# Altium schematic sheet mitosis.SchDoc
size A4
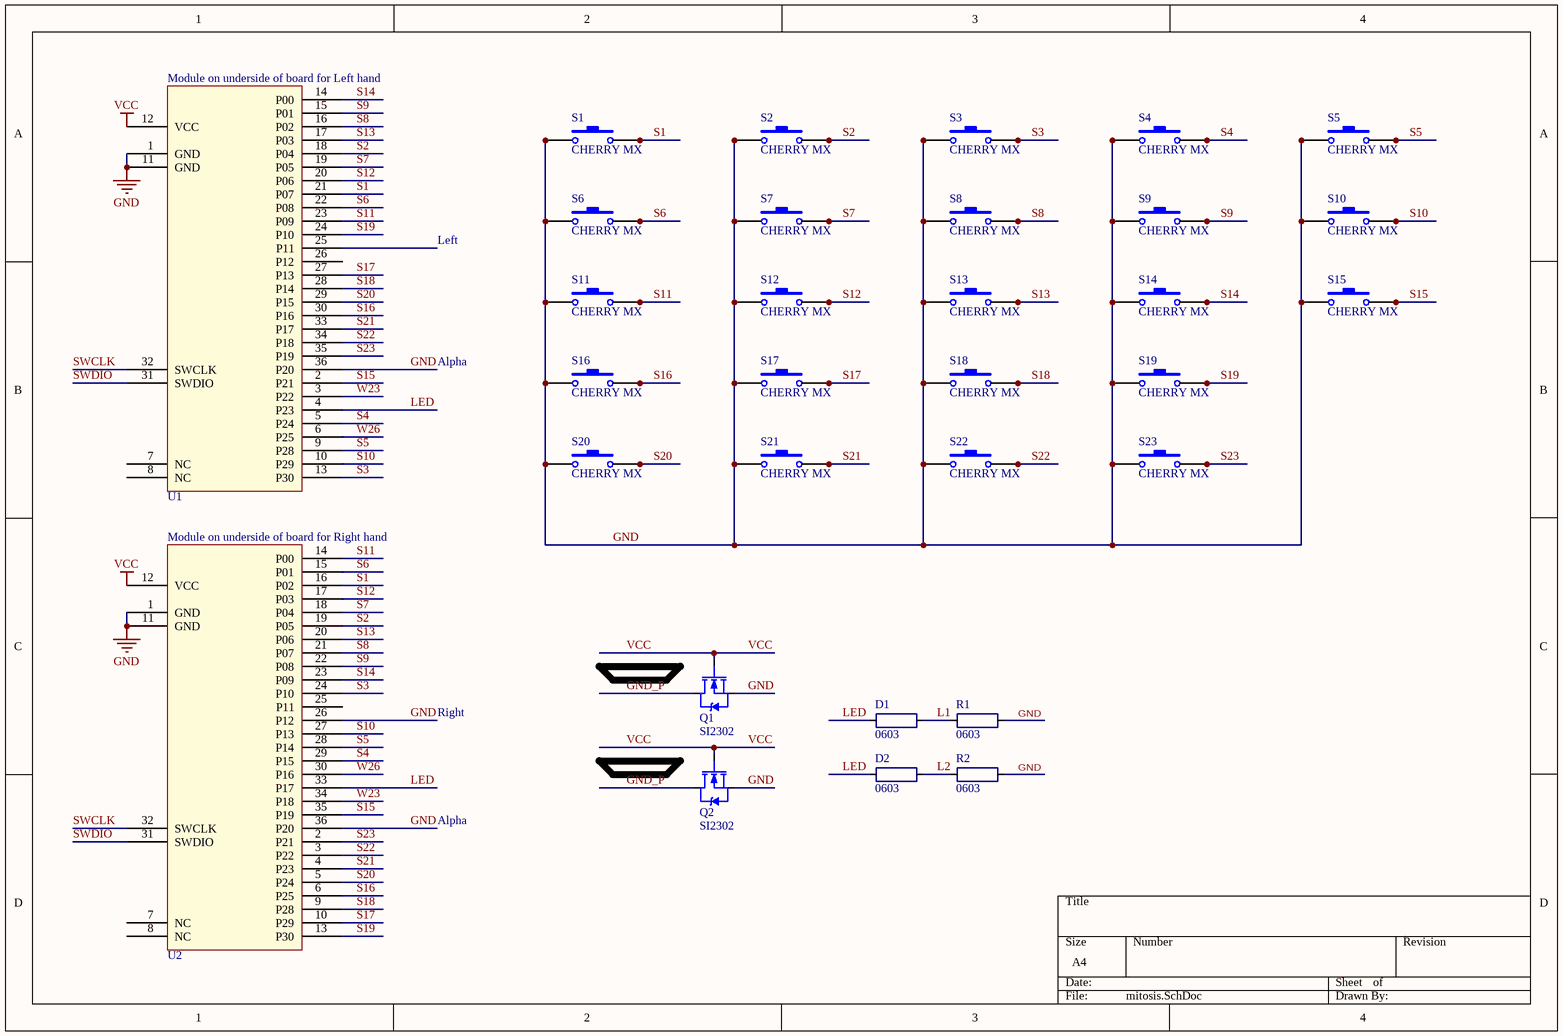
[diagram p0: mitosis.SchDoc]

## Parts
D1  0603  [RESC2012X06N]
D2  0603  [RESC2012X06N]
Q1  SI2302  [SOT-23]
Q2  SI2302  [SOT-23]
R1  0603  [RESC2012X06N]
R2  0603  [RESC2012X06N]
S1  CHERRY MX  [cherry]
S2  CHERRY MX  [cherry]
S3  CHERRY MX  [cherry]
S4  CHERRY MX  [cherry]
S5  CHERRY MX  [cherry]
S6  CHERRY MX  [cherry]
S7  CHERRY MX  [cherry]
S8  CHERRY MX  [cherry]
S9  CHERRY MX  [cherry]
S10  CHERRY MX  [cherry]
S11  CHERRY MX  [cherry]
S12  CHERRY MX  [cherry]
S13  CHERRY MX  [cherry]
S14  CHERRY MX  [cherry]
S15  CHERRY MX  [cherry]
S16  CHERRY MX  [cherry]
S17  CHERRY MX  [cherry]
S18  CHERRY MX  [cherry]
S19  CHERRY MX  [cherry]
S20  CHERRY MX  [cherry]
S21  CHERRY MX  [cherry]
S22  CHERRY MX  [cherry]
S23  CHERRY MX  [cherry]
U1  Core51822 (B)  [Core51822 (B)]  (value not drawn)
U2  Core51822 (B)  [Core51822 (B)]  (value not drawn)

## Nets
GND: Q1.2(S) Q2.2(S) R1.1 R2.1 S1.1 S1.3 S1.5 S1.7 S1.9 S1.11 S2.1 S2.3 S2.5 S2.7 S2.9 S2.11 S3.1 S3.3 S3.5 S3.7 S3.9 S3.11 S4.1 S4.3 S4.5 S4.7 S4.9 S4.11 S5.1 S5.3 S5.5 S5.7 S5.9 S5.11 S6.1 S6.3 S6.5 S6.7 S6.9 S6.11 S7.1 S7.3 S7.5 S7.7 S7.9 S7.11 S8.1 S8.3 S8.5 S8.7 S8.9 S8.11 S9.1 S9.3 S9.5 S9.7 S9.9 S9.11 S10.1 S10.3 S10.5 S10.7 S10.9 S10.11 S11.1 S11.3 S11.5 S11.7 S11.9 S11.11 S12.1 S12.3 S12.5 S12.7 S12.9 S12.11 S13.1 S13.3 S13.5 S13.7 S13.9 S13.11 S14.1 S14.3 S14.5 S14.7 S14.9 S14.11 S15.1 S15.3 S15.5 S15.7 S15.9 S15.11 S16.1 S16.3 S16.5 S16.7 S16.9 S16.11 S17.1 S17.3 S17.5 S17.7 S17.9 S17.11 S18.1 S18.3 S18.5 S18.7 S18.9 S18.11 S19.1 S19.3 S19.5 S19.7 S19.9 S19.11 S20.1 S20.3 S20.5 S20.7 S20.9 S20.11 S21.1 S21.3 S21.5 S21.7 S21.9 S21.11 S22.1 S22.3 S22.5 S22.7 S22.9 S22.11 S23.1 S23.3 S23.5 S23.7 S23.9 S23.11 U1.1(GND) U1.11(GND) U1.36(P20) U2.1(GND) U2.11(GND) U2.26(P12) U2.36(P20)
VCC: Q1.1(G) Q2.1(G) U1.12(VCC) U2.12(VCC)
GND_P: Q1.3(D) Q2.3(D)
L1: D1.1 R1.2
L2: D2.1 R2.2
LED: D1.2 D2.2 U1.4(P23) U2.33(P17)
S1: S1.2 S1.4 S1.6 S1.8 S1.10 S1.12 U1.21(P07) U2.16(P02)
S2: S2.2 S2.4 S2.6 S2.8 S2.10 S2.12 U1.18(P04) U2.19(P05)
S3: S3.2 S3.4 S3.6 S3.8 S3.10 S3.12 U1.13(P30) U2.24(P10)
S4: S4.2 S4.4 S4.6 S4.8 S4.10 S4.12 U1.5(P24) U2.29(P15)
S5: S5.2 S5.4 S5.6 S5.8 S5.10 S5.12 U1.9(P28) U2.28(P14)
S6: S6.2 S6.4 S6.6 S6.8 S6.10 S6.12 U1.22(P08) U2.15(P01)
S7: S7.2 S7.4 S7.6 S7.8 S7.10 S7.12 U1.19(P05) U2.18(P04)
S8: S8.2 S8.4 S8.6 S8.8 S8.10 S8.12 U1.16(P02) U2.21(P07)
S9: S9.2 S9.4 S9.6 S9.8 S9.10 S9.12 U1.15(P01) U2.22(P08)
S10: S10.2 S10.4 S10.6 S10.8 S10.10 S10.12 U1.10(P29) U2.27(P13)
S11: S11.2 S11.4 S11.6 S11.8 S11.10 S11.12 U1.23(P09) U2.14(P00)
S12: S12.2 S12.4 S12.6 S12.8 S12.10 S12.12 U1.20(P06) U2.17(P03)
S13: S13.2 S13.4 S13.6 S13.8 S13.10 S13.12 U1.17(P03) U2.20(P06)
S14: S14.2 S14.4 S14.6 S14.8 S14.10 S14.12 U1.14(P00) U2.23(P09)
S15: S15.2 S15.4 S15.6 S15.8 S15.10 S15.12 U1.2(P21) U2.35(P19)
S16: S16.2 S16.4 S16.6 S16.8 S16.10 S16.12 U1.30(P16) U2.6(P25)
S17: S17.2 S17.4 S17.6 S17.8 S17.10 S17.12 U1.27(P13) U2.10(P29)
S18: S18.2 S18.4 S18.6 S18.8 S18.10 S18.12 U1.28(P14) U2.9(P28)
S19: S19.2 S19.4 S19.6 S19.8 S19.10 S19.12 U1.24(P10) U2.13(P30)
S20: S20.2 S20.4 S20.6 S20.8 S20.10 S20.12 U1.29(P15) U2.5(P24)
S21: S21.2 S21.4 S21.6 S21.8 S21.10 S21.12 U1.33(P17) U2.4(P23)
S22: S22.2 S22.4 S22.6 S22.8 S22.10 S22.12 U1.34(P18) U2.3(P22)
S23: S23.2 S23.4 S23.6 S23.8 S23.10 S23.12 U1.35(P19) U2.2(P21)
SWCLK: U1.32(SWCLK) U2.32(SWCLK)
SWDIO: U1.31(SWDIO) U2.31(SWDIO)
W23: U1.3(P22) U2.34(P18)
W26: U1.6(P25) U2.30(P16)

Not connected (* = marked no-connect by the designer): U1 7(NC) 8(NC) 25(P11) 26(P12); U2 7(NC) 8(NC) 25(P11)

## Notes on the sheet
- (near U1) Module on underside of board for Left hand
- Left
- Alpha
- (near U2) Module on underside of board for Right hand
- Right

## Library data of the parts
Q1 Q2 = SI2302: N-Channel Logic MOSFET; Note: Pin 2 is electrically connected to pin 4.; Published: 8-Jun-2000; LatestRevisionDate: 17-Jul-2002; LatestRevisionNote: Re-released for DXP Platform.; DatasheetVersion: PD-9.814; PackageVersion: Feb-1997; PackageReference: TO-220AB; Publisher: Altium Limited; PackageDescription: TO, Thru-Hole, Vertical, Heatsink Mounted; 3 In-Line Leads; Pitch 2.54 mm; ComponentLink1Description: Manufacturer Link; ComponentLink1URL: http://www.irf.com/
S1-S23 = CHERRY MX: Switch; Published: 24-Mar-1999; LatestRevisionDate: 17-Jul-2002; LatestRevisionNote: Re-released for DXP Platform.; PackageReference: SPST-2; Publisher: Altium Limited; PackageDescription: Switch; 2 Leads
U1 U2 = Core51822 (B): NRF51822 (B)